# EAGLE schematic untitled upd (EAGLE 7.5.0)
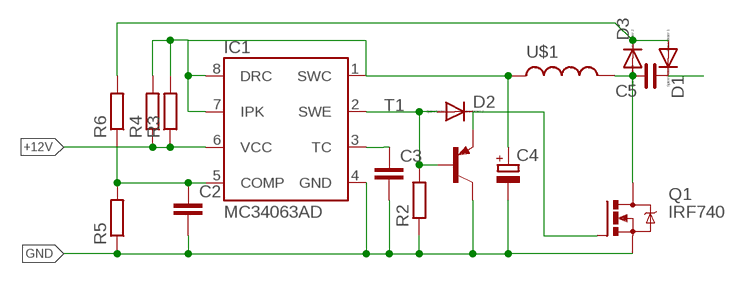
[diagram p0: schematic, sheet 1]

## Parts
C2  C-EUC0805K  [C0805K]
C3  C-EUC0805K  [C0805K]
C4  CPOL-EU153CLV-0605  [153CLV-0605]
C5  C_0805  [C0805]
D1  DIODE-DO-214AC  [DO-214AC]
D2  DIODE-DO-214AC  [DO-214AC]
D3  DIODE-DO-214AC  [DO-214AC]
IC1  MC34063AD  [SO08]
Q1  IRF740  [TO220BV]
R2  R-EU_M0805  [M0805]
R3  R-EU_M0805  [M0805]
R4  R-EU_M0805  [M0805]
R5  R-EU_M0805  [M0805]
R6  R-EU_M0805  [M0805]
T1  BC807-16-PNP-SOT23-BEC  [SOT23-BEC]
U$1  MSS1260  [MSS1260]

## Nets
+12V: IC1.6(VCC) R3.1 R4.1
GND: C2.2 C3.2 C4.- IC1.4(GND) Q1.S R2.1 R5.1 T1.C
N$1: C5.1 D1.C
N$2: D2.C Q1.G T1.E
N$3: D2.A IC1.2(SWE) R2.2 T1.B
N$5: C4.+ IC1.1(SWC) IC1.7(IPK) IC1.8(DRC) R3.2 R4.2 U$1.P$2
N$6: C3.1 IC1.3(TC)
N$7: C2.1 IC1.5(COMP) R5.2 R6.1
N$8: D1.A D3.C R6.2
N$24: C5.2 D3.A Q1.D U$1.P$1

## Library data of the parts
C2 C3 = rcl-2:C-EU: CAPACITOR, European symbol
C4 = resistor:CPOL-EU: POLARIZED CAPACITOR, European symbol
C5 = rc-master:C_: NON-POLARIZED CAP
D1-D3 = diode:DIODE-: DIODE
IC1 = v-reg-3:MC34063A: 1.5A Step-Up/Down/Inverting Switching Regulator NPN Darlington Switch, Vin 3V to 40V, Current Limiter Input, adjustable Frequency up to 100kHz
Q1 = transistor-power:IRF740: N-CHANNEL MOS FET
R2-R6 = rcl-2:R-EU_: RESISTOR, European symbol
T1 = transistor:*-PNP-: PNP Transistror
U$1 = inductor-coilcraft:MSS1260: SMT Power Inductor